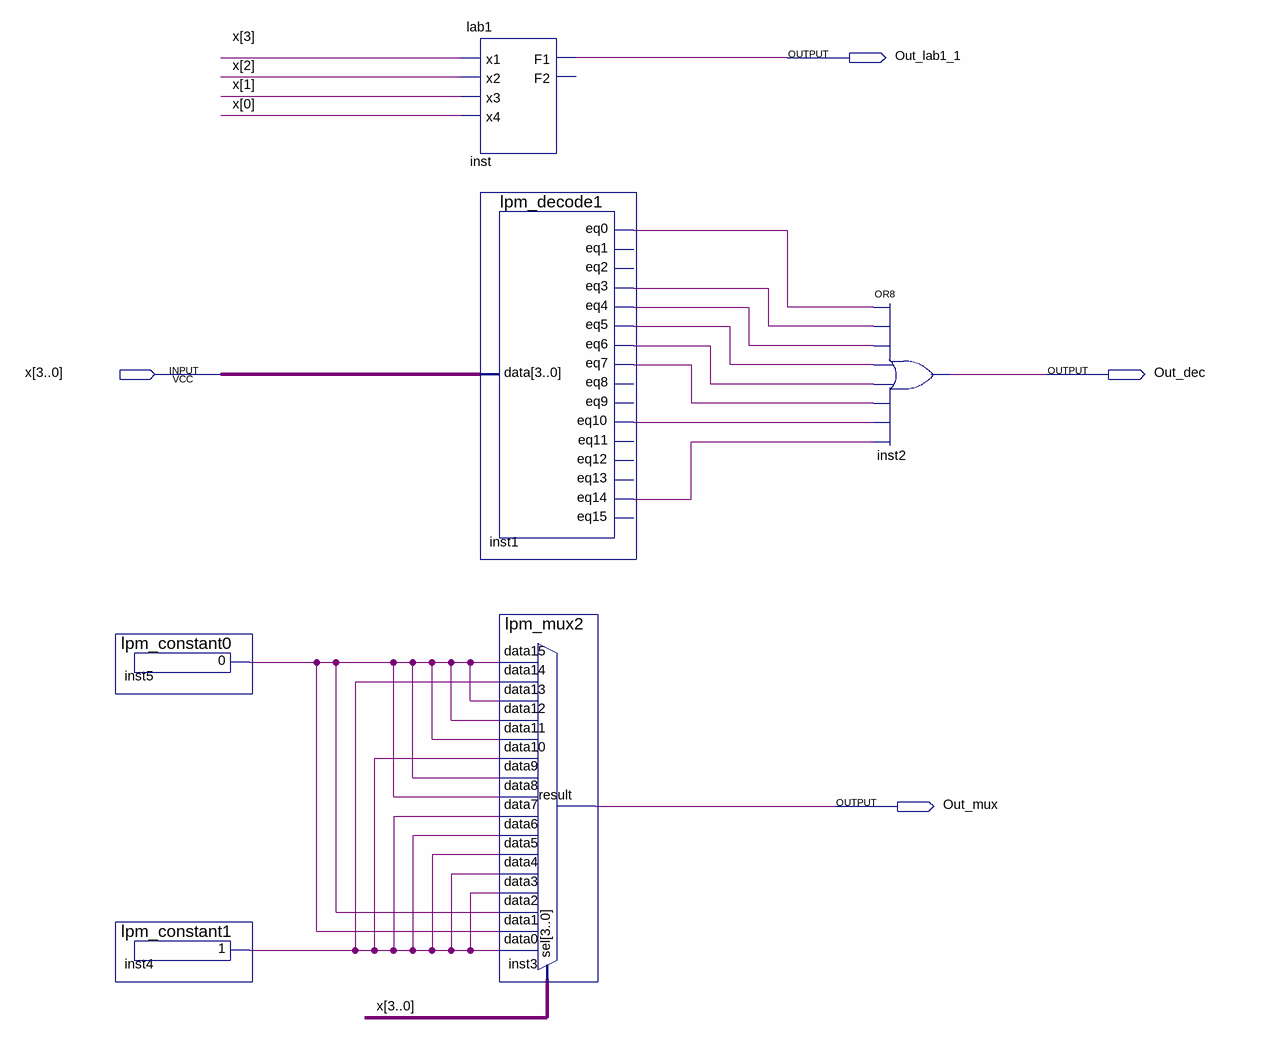
[diagram p0: schematic sheet]
// Quartus schematic lab2.bdf as structural Verilog: 6 symbols, 4 pins
module lab2 (
  input  [3:0] x,
  output Out_lab1_1,
  output Out_dec,
  output Out_mux
);

  wire inst1_eq0, inst1_eq3, inst1_eq4, inst1_eq5, inst1_eq6, inst1_eq7, inst1_eq10, inst1_eq14,
       inst4_result, inst5_result;

  lpm_constant0 inst5 (.result(inst5_result));
  lpm_constant1 inst4 (.result(inst4_result));
  lab1 inst (.x1(x[3]), .x2(x[2]), .x3(x[1]), .x4(x[0]), .F1(Out_lab1_1));  // open: F2
  lpm_decode1 inst1 (
    .data(x), .eq0(inst1_eq0), .eq3(inst1_eq3), .eq4(inst1_eq4), .eq5(inst1_eq5), .eq6(inst1_eq6),
    .eq7(inst1_eq7), .eq10(inst1_eq10), .eq14(inst1_eq14));  // open: eq1, eq2, eq8, eq9, eq11, eq12, eq13, eq15
  lpm_mux2 inst3 (
    .data15(inst5_result), .data14(inst4_result), .data13(inst5_result), .data12(inst5_result),
    .data11(inst5_result), .data10(inst4_result), .data9(inst5_result), .data8(inst5_result),
    .data7(inst4_result), .data6(inst4_result), .data5(inst4_result), .data4(inst4_result),
    .data3(inst4_result), .data2(inst5_result), .data1(inst5_result), .data0(inst4_result), .sel(x),
    .result(Out_mux));
  or inst2 (Out_dec, inst1_eq0, inst1_eq3, inst1_eq4, inst1_eq5, inst1_eq6, inst1_eq7, inst1_eq10, inst1_eq14);
endmodule
